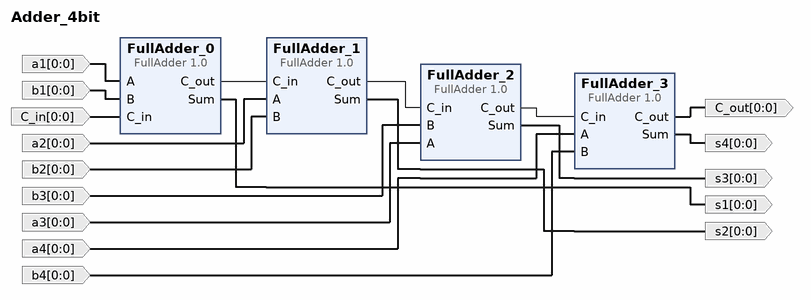
[diagram p0: block diagram of the top level]
# Vivado block design Adder_4bit, xc7k325tffg900-2, Vivado 2019.1
create_bd_design Adder_4bit

create_bd_port -dir I -from 0 -to 0 C_in
create_bd_port -dir I -from 0 -to 0 a1
create_bd_port -dir I -from 0 -to 0 a2
create_bd_port -dir I -from 0 -to 0 a3
create_bd_port -dir I -from 0 -to 0 a4
create_bd_port -dir I -from 0 -to 0 b4
create_bd_port -dir I -from 0 -to 0 b3
create_bd_port -dir I -from 0 -to 0 b2
create_bd_port -dir I -from 0 -to 0 b1
create_bd_port -dir O -from 0 -to 0 s1
create_bd_port -dir O -from 0 -to 0 s2
create_bd_port -dir O -from 0 -to 0 s3
create_bd_port -dir O -from 0 -to 0 s4
create_bd_port -dir O -from 0 -to 0 C_out

create_bd_cell -type ip -vlnv xilinx.com:user:FullAdder:1.0 FullAdder_0
create_bd_cell -type ip -vlnv xilinx.com:user:FullAdder:1.0 FullAdder_1
create_bd_cell -type ip -vlnv xilinx.com:user:FullAdder:1.0 FullAdder_2
create_bd_cell -type ip -vlnv xilinx.com:user:FullAdder:1.0 FullAdder_3

# ---- connections ----

connect_bd_net -net a1_1 [get_bd_ports a1] [get_bd_pins FullAdder_0/A]
connect_bd_net -net b1_1 [get_bd_ports b1] [get_bd_pins FullAdder_0/B]
connect_bd_net [get_bd_ports C_in] [get_bd_pins FullAdder_0/C_in]
connect_bd_net [get_bd_pins FullAdder_0/Sum] [get_bd_ports s1]
connect_bd_net [get_bd_pins FullAdder_0/C_out] [get_bd_pins FullAdder_1/C_in]
connect_bd_net -net a2_1 [get_bd_ports a2] [get_bd_pins FullAdder_1/A]
connect_bd_net -net b2_1 [get_bd_ports b2] [get_bd_pins FullAdder_1/B]
connect_bd_net [get_bd_pins FullAdder_1/C_out] [get_bd_pins FullAdder_2/C_in]
connect_bd_net -net b3_1 [get_bd_ports b3] [get_bd_pins FullAdder_2/B]
connect_bd_net -net a3_1 [get_bd_ports a3] [get_bd_pins FullAdder_2/A]
connect_bd_net [get_bd_pins FullAdder_1/Sum] [get_bd_ports s2]
connect_bd_net -net a4_1 [get_bd_ports a4] [get_bd_pins FullAdder_3/A]
connect_bd_net -net b4_1 [get_bd_ports b4] [get_bd_pins FullAdder_3/B]
connect_bd_net [get_bd_pins FullAdder_2/C_out] [get_bd_pins FullAdder_3/C_in]
connect_bd_net [get_bd_pins FullAdder_2/Sum] [get_bd_ports s3]
connect_bd_net [get_bd_pins FullAdder_3/Sum] [get_bd_ports s4]
connect_bd_net [get_bd_pins FullAdder_3/C_out] [get_bd_ports C_out]

validate_bd_design
save_bd_design
